# EAGLE schematic 555-light-buzzer (EAGLE 7.5.0)
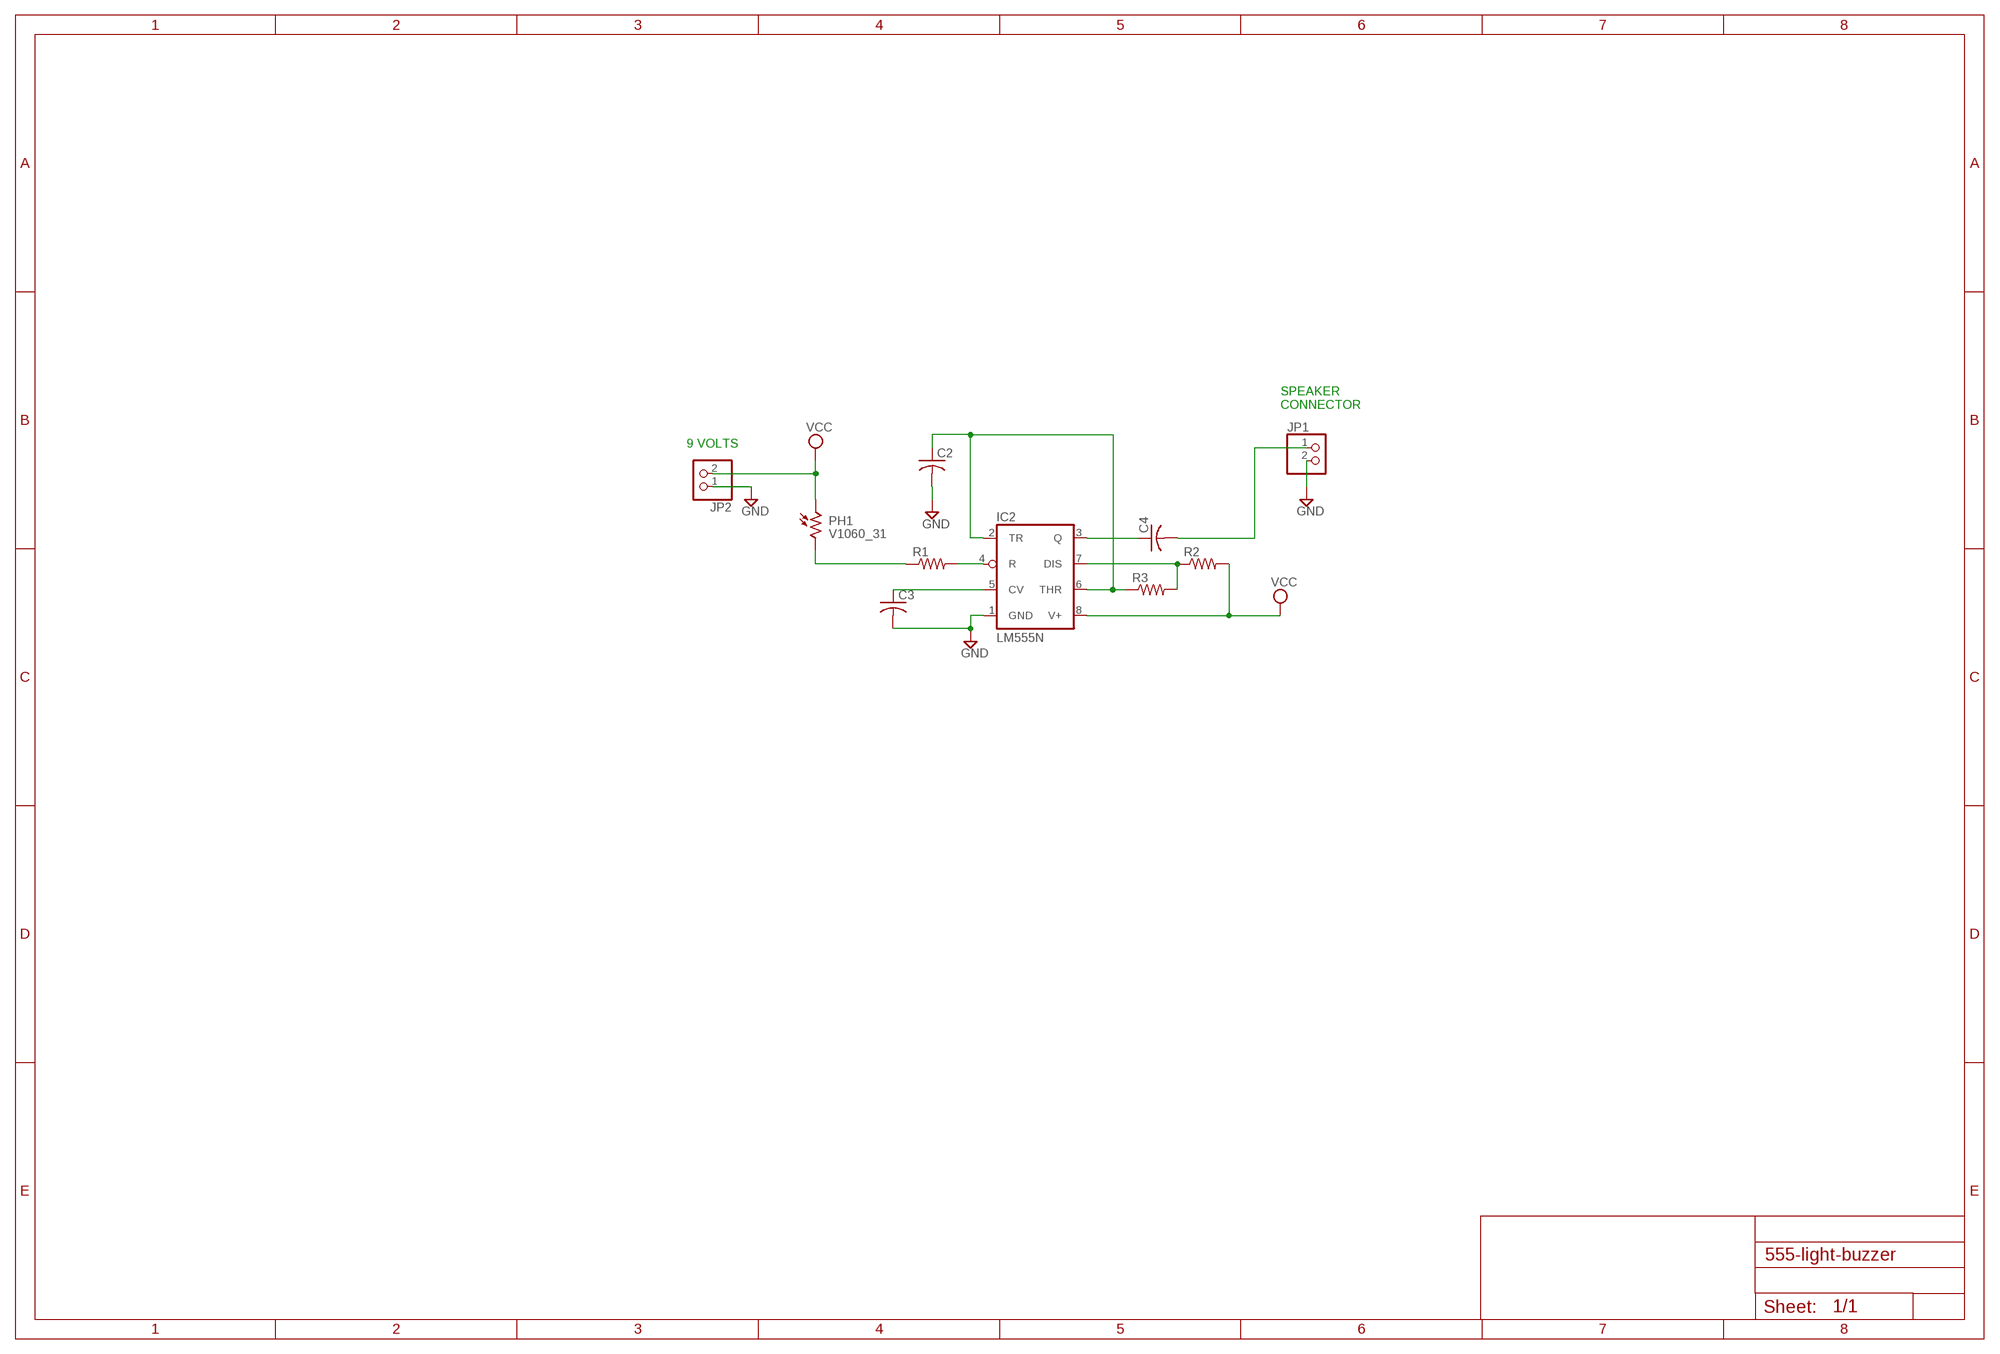
[diagram p0: schematic, sheet 1]

## Parts
C2  C-US050-050X075  [C050-050X075]
C3  C-US050-050X075  [C050-050X075]
C4  C-US050-050X075  [C050-050X075]
IC2  LM555N  [DIL08]
JP1  PINHD-1X2  [1X02]
JP2  PINHD-1X2  [1X02]
PH1  V1060_31  [TO-5_V10]
R1  R-US_0207/10  [0207/10]
R2  R-US_0207/10  [0207/10]
R3  R-US_0207/10  [0207/10]

## Nets
GND: C2.2 C3.2 IC2.1(GND) JP1.2 JP2.1
N$2: C3.1 IC2.5(CV)
N$3: IC2.4(R) R1.2
N$4: PH1.2 R1.1
N$5: C2.1 IC2.2(TR) IC2.6(THR) R3.1
N$6: C4.1 IC2.3(Q)
N$7: C4.2 JP1.1
N$9: IC2.7(DIS) R2.1 R3.2
VCC: IC2.8(V+) JP2.2 PH1.1 R2.2

## Notes on the sheet
- SPEAKER 
  CONNECTOR
- 9 VOLTS

## Library data of the parts
C2-C4 = resistor:C-US: CAPACITOR, American symbol
IC2 = linear:*555: TIMER
JP1 JP2 = pinhead:PINHD-1X2: PIN HEADER
PH1 = photo-elements:?1060*: Sensor Street Light control Source: http://optoelectronics.perkinelmer.com/content/Datasheets/DTS_PhotocellsB1060.pdf
R1-R3 = resistor:R-US_: RESISTOR, American symbol